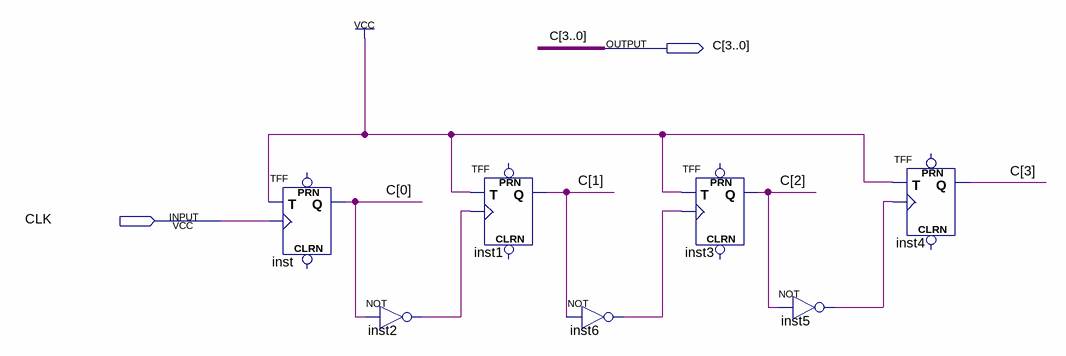
[diagram p0: schematic sheet]
// Quartus schematic ContadorMod16T.bdf as structural Verilog: 7 symbols, 2 pins
module ContadorMod16T (
  input  CLK,
  output [3:0] C
);

  wire inst2_out, inst5_out, inst6_out;

  TFF inst (.T(1'b1), .CLK(CLK), .Q(C[0]));  // open: PRN, CLRN
  not inst2 (inst2_out, C[0]);
  TFF inst1 (.T(1'b1), .CLK(inst2_out), .Q(C[1]));  // open: PRN, CLRN
  not inst6 (inst6_out, C[1]);
  TFF inst3 (.T(1'b1), .CLK(inst6_out), .Q(C[2]));  // open: PRN, CLRN
  not inst5 (inst5_out, C[2]);
  TFF inst4 (.T(1'b1), .CLK(inst5_out), .Q(C[3]));  // open: PRN, CLRN
endmodule
